# Altium schematic sheet esp32_ethernet1.SchDoc
size A4; SheetNumber: 2; SheetTotal: 2
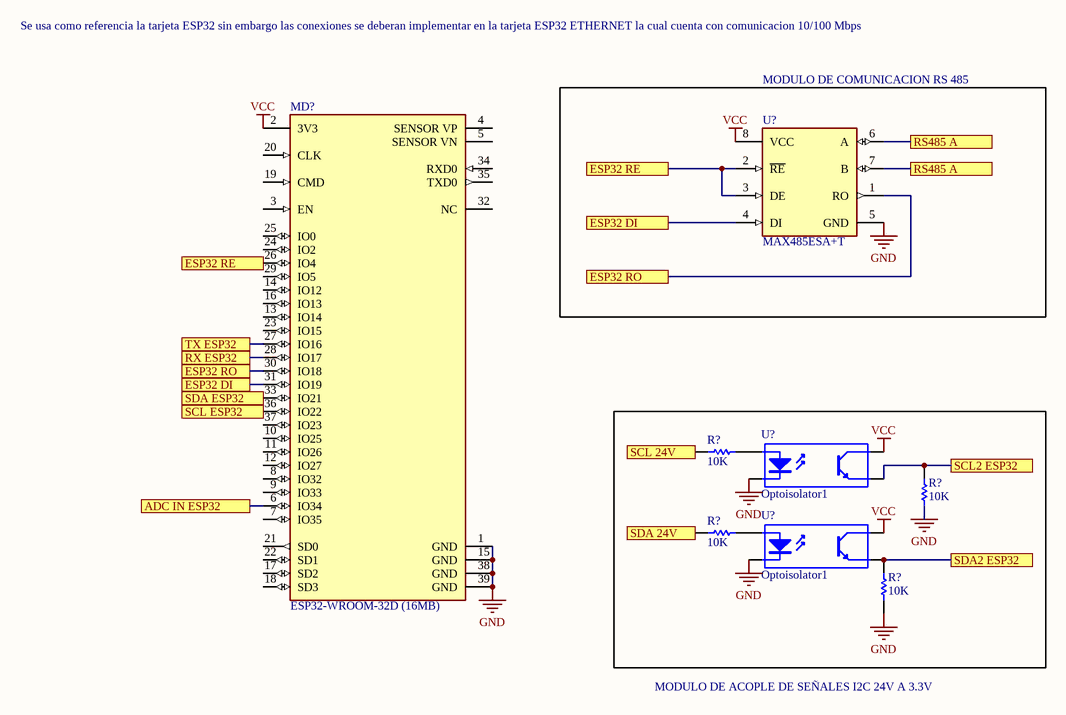
[diagram p0: esp32_ethernet1.SchDoc]

## Parts
(Parts that share a designator on the sheet are numbered #1, #2 ... from top to bottom, then left to right.)
MD?  ESP32-WROOM-32D (16MB)  [FP-ESP32-WROOM-32D_16MB-MFG]
R?#1  value 10K  (hidden comment: Resistor)
R?#2  value 10K  (hidden comment: Resistor)
R?#3  value 10K  (hidden comment: Resistor)
R?#4  value 10K  (hidden comment: Resistor)
U?#1  MAX485ESA+T  [FP-S8-2-MFG]
U?#2  Optoisolator1  [DIP-4]
U?#3  Optoisolator1  [DIP-4]

## Blocks framed on the sheet
MODULO DE COMUNICACION RS 485: U?#1

## Ports
ADC IN ESP32, ESP32 DI, ESP32 RE, ESP32 RO, RS485 A, RX ESP32, SCL2 ESP32 , SCL 24V, SCL ESP32, SDA2 ESP32 , SDA 24V, SDA ESP32, TX ESP32

## Nets
GND: MD?.1(GND) MD?.15(GND) MD?.38(GND) MD?.39(GND) R?#2.1 R?#4.1 U?#1.5(GND) U?#2.2(K) U?#3.2(K)
VCC: MD?.2(3V3) U?#1.8(VCC) U?#2.4(C) U?#3.4(C)
ADC IN ESP32: MD?.6(IO34) ; port ADC IN ESP32
ESP32 DI: MD?.31(IO19) U?#1.4(DI) ; port ESP32 DI
ESP32 RE: MD?.26(IO4) U?#1.2(~{RE}) U?#1.3(DE) ; port ESP32 RE
ESP32 RO: MD?.30(IO18) U?#1.1(RO) ; port ESP32 RO
RS485 A: U?#1.6(A) U?#1.7(B) ; port RS485 A
RX ESP32: MD?.28(IO17) ; port RX ESP32
SCL2 ESP32 : R?#2.2 U?#2.3(E) ; port SCL2 ESP32 
SCL 24V: R?#1.1 ; port SCL 24V
SCL ESP32: MD?.36(IO22) ; port SCL ESP32
SDA2 ESP32 : R?#4.2 U?#3.3(E) ; port SDA2 ESP32 
SDA 24V: R?#3.1 ; port SDA 24V
SDA ESP32: MD?.33(IO21) ; port SDA ESP32
TX ESP32: MD?.27(IO16) ; port TX ESP32
NetR?#1_2: R?#1.2 U?#2.1(A)
NetR?#3_2: R?#3.2 U?#3.1(A)

Not connected (* = marked no-connect by the designer): MD? 3(EN) 4(SENSOR_VP) 5(SENSOR_VN) 7(IO35) 8(IO32) 9(IO33) 10(IO25) 11(IO26) 12(IO27) 13(IO14) 14(IO12) 16(IO13) 17(SD2) 18(SD3) 19(CMD) 20(CLK) 21(SD0) 22(SD1) 23(IO15) 24(IO2) 25(IO0) 29(IO5) 32(NC) 34(RXD0) 35(TXD0) 37(IO23)

## Notes on the sheet
- Se usa como referencia la tarjeta ESP32 sin embargo las conexiones se deberan implementar en la tarjeta ESP32 ETHERNET la cual cuenta con comunicacion 10/100 Mbps
- MODULO DE ACOPLE DE SEÑALES I2C 24V A 3.3V

## Library data of the parts
MD? = CMP-194065-000022-1: RX TXRX MOD WIFI TRACE ANT SMD; Data Rate: 150Mbps; Memory Size: 536KB; Interface: I2C; Frequency: 2.5GHz; Sensitivity: -98dBm; Packaging: Tape and Reel; Min Operating Temperature: -40°C; Max Operating Temperature: 85°C; Mount: Surface Mount; Case/Package: SMD/SMT
R?#1-R?#4 = Resistor: TC1: 0; SimulationGenericComponent: True; TC2: 0
U?#1 = CMP-05679-000009-1: IC TRANSCEIVER HALF 1/1 8SOIC; Manufacturer: Maxim Integrated; Min Supply Voltage: 4.75V; Nominal Supply Current: 0.5mA; Number Of Transmitters: 1; Data Rate: 2.5Mbits/s; Interface: RS-485,RS-422; Description: 1/1 Transceiver Half RS422, RS485 8-SOIC; Standoff Height: 0.1mm; Max Supply Voltage: 5.25V; Simplex Duplex: Half-Duplex; Package: S8-2; Temperature: -40°C to +85°C; Device Class L1: Integrated Circuits (ICs); Footprint Url: https://pdfserv.maximintegrated.com/land_patterns/90-0096.PDF; ComponentLink2URL: https://datasheets.maximintegrated.com/en/ds/MAX1487-MAX491.pdf; Height: 1.75mm; Mouser Description: RS-422/RS-485 Interface IC RS-485/RS-422 Transceiver; Octopart: https://octopart.com/max485esa%2Bt-maxim+integrated-40011239; RoHS: TRUE; ComponentLink2Description: Datasheet; Temperature Range Low: -40°C; Number Of Receivers: 1; Manufacturer Part Number: MAX485ESA+T; Ipc Land Pattern Name: SOIC127P600X155-8; Device Class L3: RS-232 / RS-422 / RS-485 Interface ICs; Automotive: No; Digikey Description: IC TRANSCEIVER HALF 1/1 8SOIC; Temperature Range High: +85°C; Category: IC; Device Class L2: Interface ICs; Lead Free: Yes
U?#2 U?#3 = Optoisolator1: 4-Pin Phototransistor Optocoupler; Published: 24-Mar-1999; LatestRevisionDate: 04-Mar-2005; LatestRevisionNote: Sch pins 3 & 4 Swapped.; DatasheetVersion: Nov-2003; PackageReference: DIP-4; Publisher: Altium Limited